# Altium schematic sheet lampi_power.SchDoc
size A
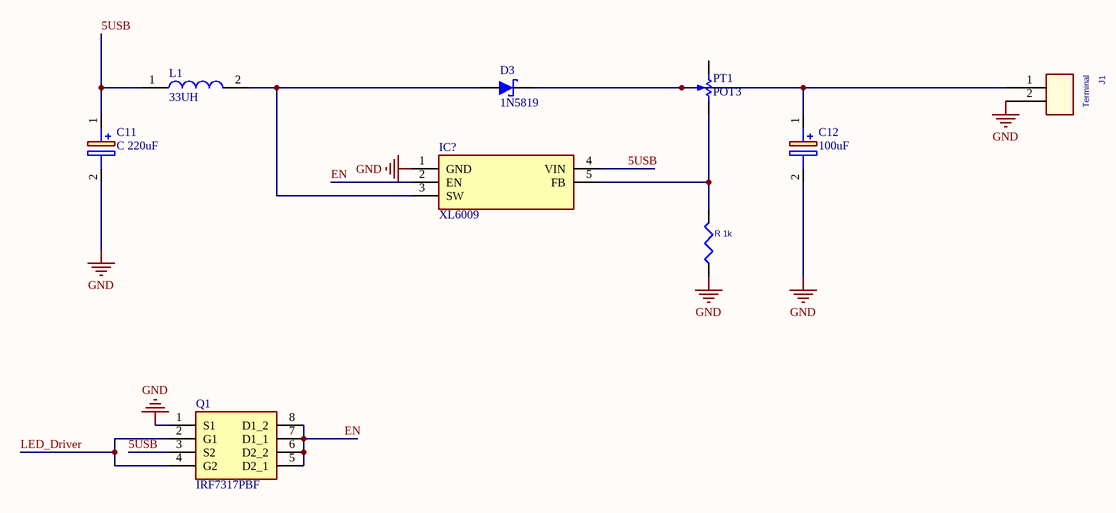
[diagram p0: lampi_power.SchDoc]

## Parts
C11  C 220uF  [UWT(8X10)]
C12  100uF  [UWT(8X10)]
D3  1N5819  [430X270D]
IC?  XL6009  [KTT0005B]
J1  Terminal  [TB_2]
L1  33UH  [SRR1260-150M]
PT1  POT3  [POT3]
Q1  IRF7317PBF  [SOIC127P600X175-8N]
R_1k  *  [0805L]  (value not drawn)

## Nets
GND: C11.2(-) C12.2(-) IC?.1(GND) J1.2 Q1.1(S1) R_1k.1
5USB: C11.1(+) IC?.4(VIN) L1.1 Q1.3(S2)
EN: IC?.2(EN) Q1.5(D2_1) Q1.6(D2_2) Q1.7(D1_1) Q1.8(D1_2)
LED_Driver: Q1.2(G1) Q1.4(G2)
NetC12_1: C12.1(+) D3.2 J1.1 PT1.3(TAP)
NetD3_1: D3.1 IC?.3(SW) L1.2
NetIC?_5: IC?.5(FB) PT1.2(BOT) R_1k.2

Not connected (* = marked no-connect by the designer): PT1 1(TOP)

## Library data of the parts
C11 C12 = UCW1V221MNL1GS: Capacitor Polarised; Manufacturer_Name: Nichicon; Allied_Number: 70409419; Datasheet Link: http://www.nichicon.co.jp/english/products/pdfs/e-ucw.pdf; Manufacturer_Part_Number: UCW1V221MNL1GS; Mouser Part Number: 647-UCW1V221MNL1GS; Mouser Price/Stock: https://www.mouser.com/Search/Refine.aspx?Keyword=647-UCW1V221MNL1GS; RS Part Number: 7151745P; RS Price/Stock: http://uk.rs-online.com/web/p/products/7151745P; Allied Price/Stock: https://www.alliedelec.com/nichicon-ucw1v221mnl1gs/70409419/
IC? = XL6009: Integrated Circuit; Manufacturer_Name: Texas Instruments; Manufacturer_Part_Number: LM2577SX-ADJ/NOPB; Datasheet Link: http://www.ti.com/lit/gpn/LM2577; Mouser Part Number: 926-LM2577SXADJNOPB; Mouser Price/Stock: https://www.mouser.com/Search/Refine.aspx?Keyword=926-LM2577SXADJNOPB
J1 = CON2
L1 = SRR1260-330M: Inductor; Manufacturer_Name: Bourns; Allied_Number: 70277066; Datasheet Link: https://www.bourns.com/docs/Product-Datasheets/SRR1260.pdf; Manufacturer_Part_Number: SRR1260-330M; Mouser Part Number: 652-SRR1260-330M; Mouser Price/Stock: https://www.mouser.com/Search/Refine.aspx?Keyword=652-SRR1260-330M; RS Part Number: 6934619P; RS Price/Stock: http://uk.rs-online.com/web/p/products/6934619P; Allied Price/Stock: https://www.alliedelec.com/bourns-srr1260-330m/70277066/
PT1 = POT3: Variable Potentiometer top adjust; Designer: Seyed Mohsen Ghasemian; WEB: www.picpars.com
Q1 = IRF7317PBF: Transistor; Manufacturer_Name: Infineon; Allied_Number: 70018231; Datasheet Link: http://www.infineon.com/dgdl/irf7317pbf.pdf?fileId=5546d462533600a4015355f5b8de1b3d; Height: 1.75mm; Manufacturer_Part_Number: IRF7317PBF; Mouser Part Number: 942-IRF7317PBF; Mouser Price/Stock: https://www.mouser.com/Search/Refine.aspx?Keyword=942-IRF7317PBF; RS Part Number: 5410317P; RS Price/Stock: http://uk.rs-online.com/web/p/products/5410317P; Allied Price/Stock: https://www.alliedelec.com/infineon-irf7317pbf/70018231/
R_1k = R: Value: *